# EAGLE schematic ECE445_VOLTAGE_DIVIDER (EAGLE 8.6.1)
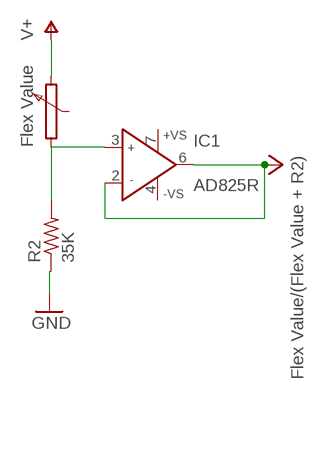
[diagram p0: schematic, sheet 1]

## Parts
IC1  AD825R  [SO8]
R2  35K  R-US_0204/2V  [0204V]

## Nets
GND: R2.1
N$1: IC1.3(IN+) R2.2
V+: IC1.2(IN-) IC1.6(OUT) ; supply symbol labelled Flex Value/(Flex Value + R2)
Unconnected: IC1.4(-VS) IC1.7(+VS)

## Notes on the sheet
- Flex Value

## Library data of the parts
IC1 = analog-devices:AD825: Low Cost, General-Purpose High Speed JFET Amplifier Source: http://www.analog.com/static/imported-files/data_sheets/AD825.pdf; MF: ALTERA CORPORATION; MPN: AD825ARZ; OC_FARNELL: 9603735; OC_NEWARK: 59K6528
R2 = rcl:R-US_: RESISTOR, American symbol; SPICEPREFIX: R